# EAGLE schematic S7G7_footprint_simplified_w_ethernet_v1p5 (EAGLE 9.3.1)
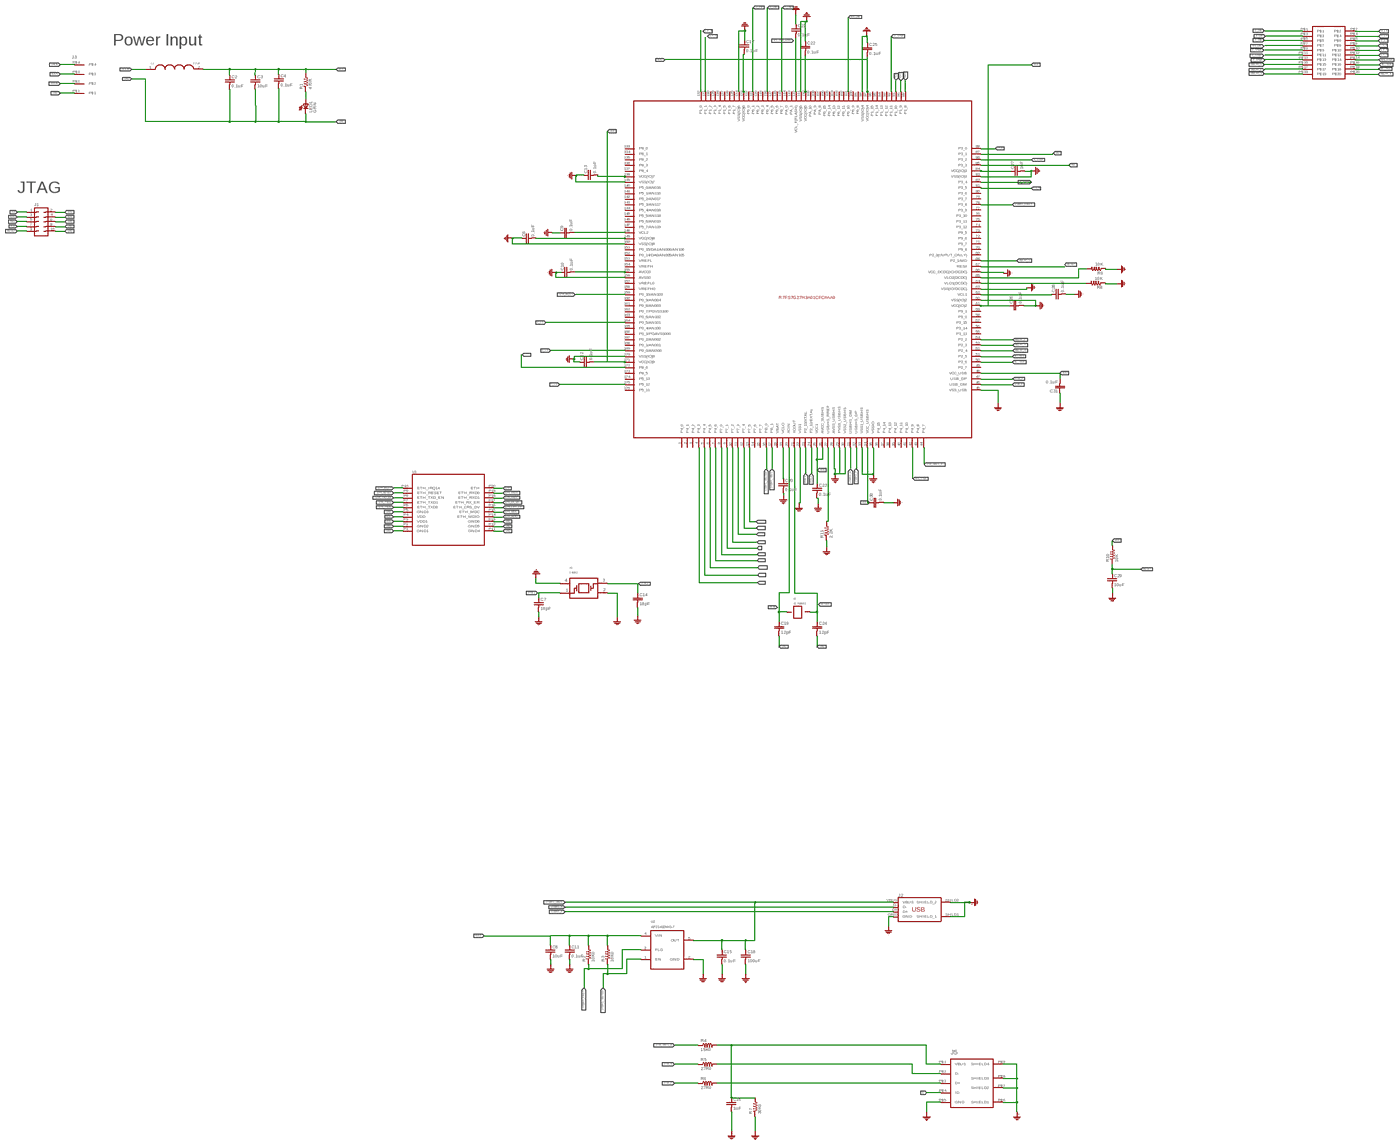
[diagram p0: schematic, sheet 1, overview]
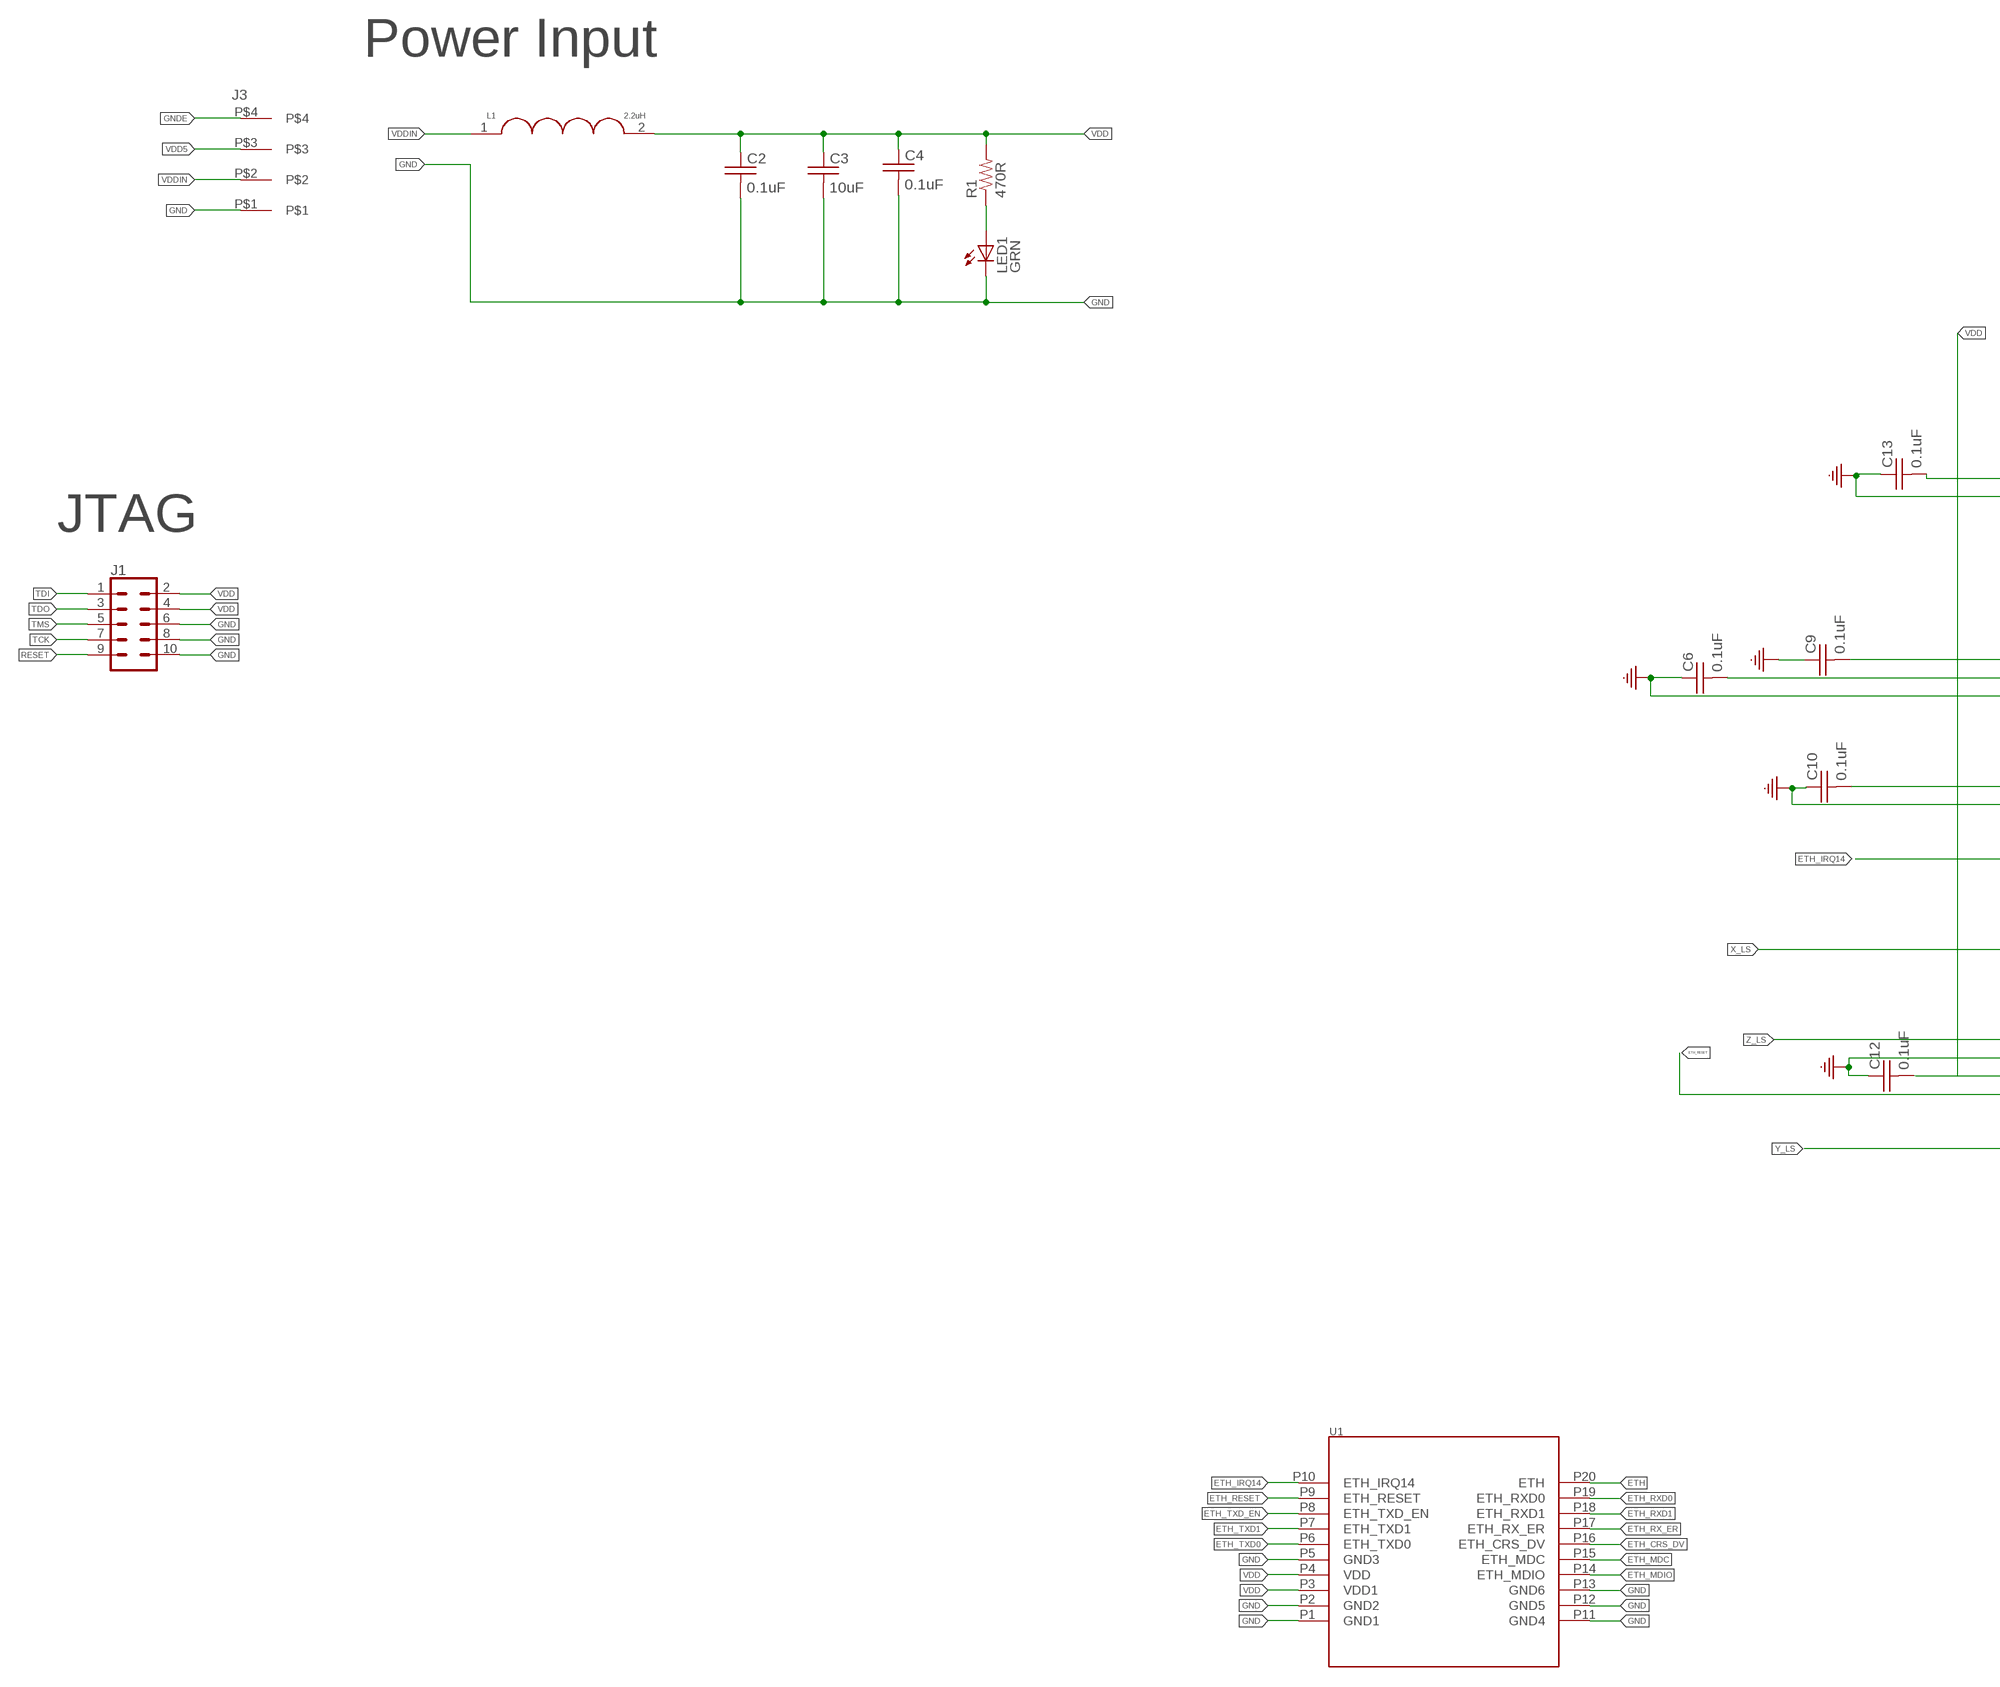
[diagram p1: schematic, sheet 1, part 1 of 4]
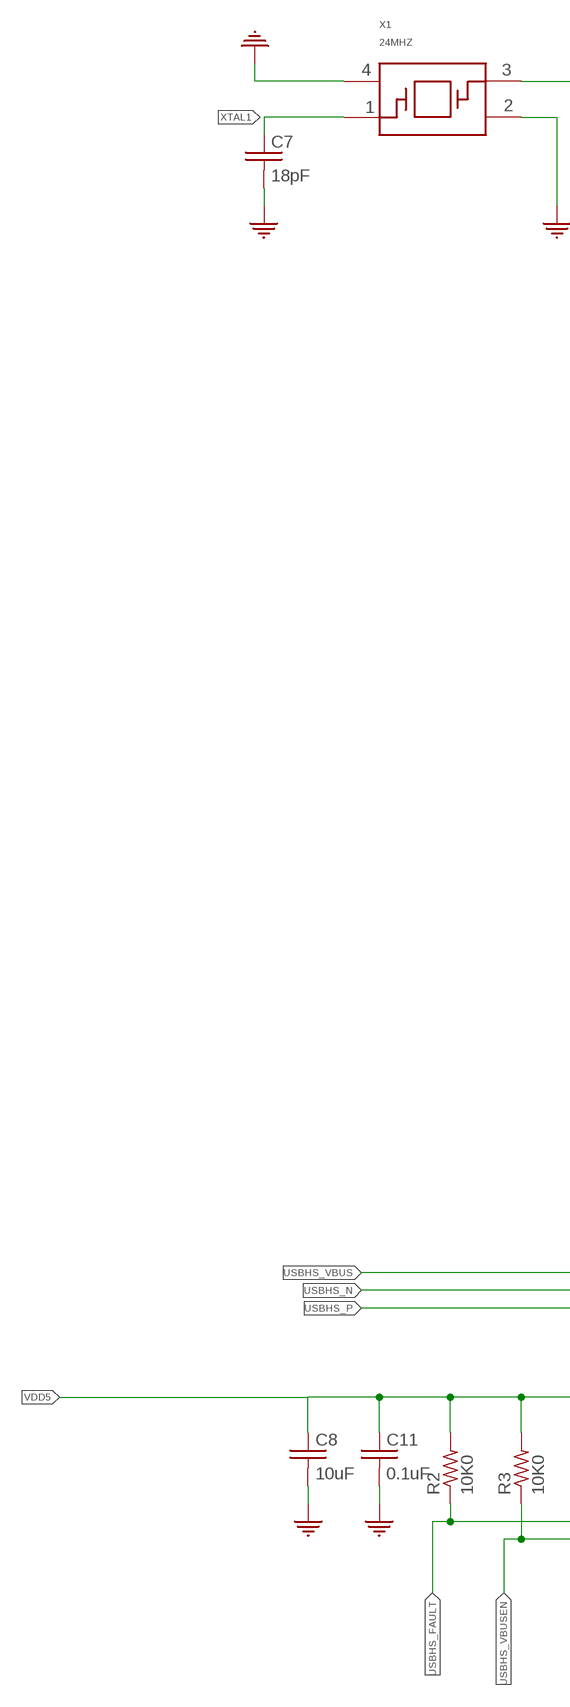
[diagram p2: schematic, sheet 1, part 2 of 4]
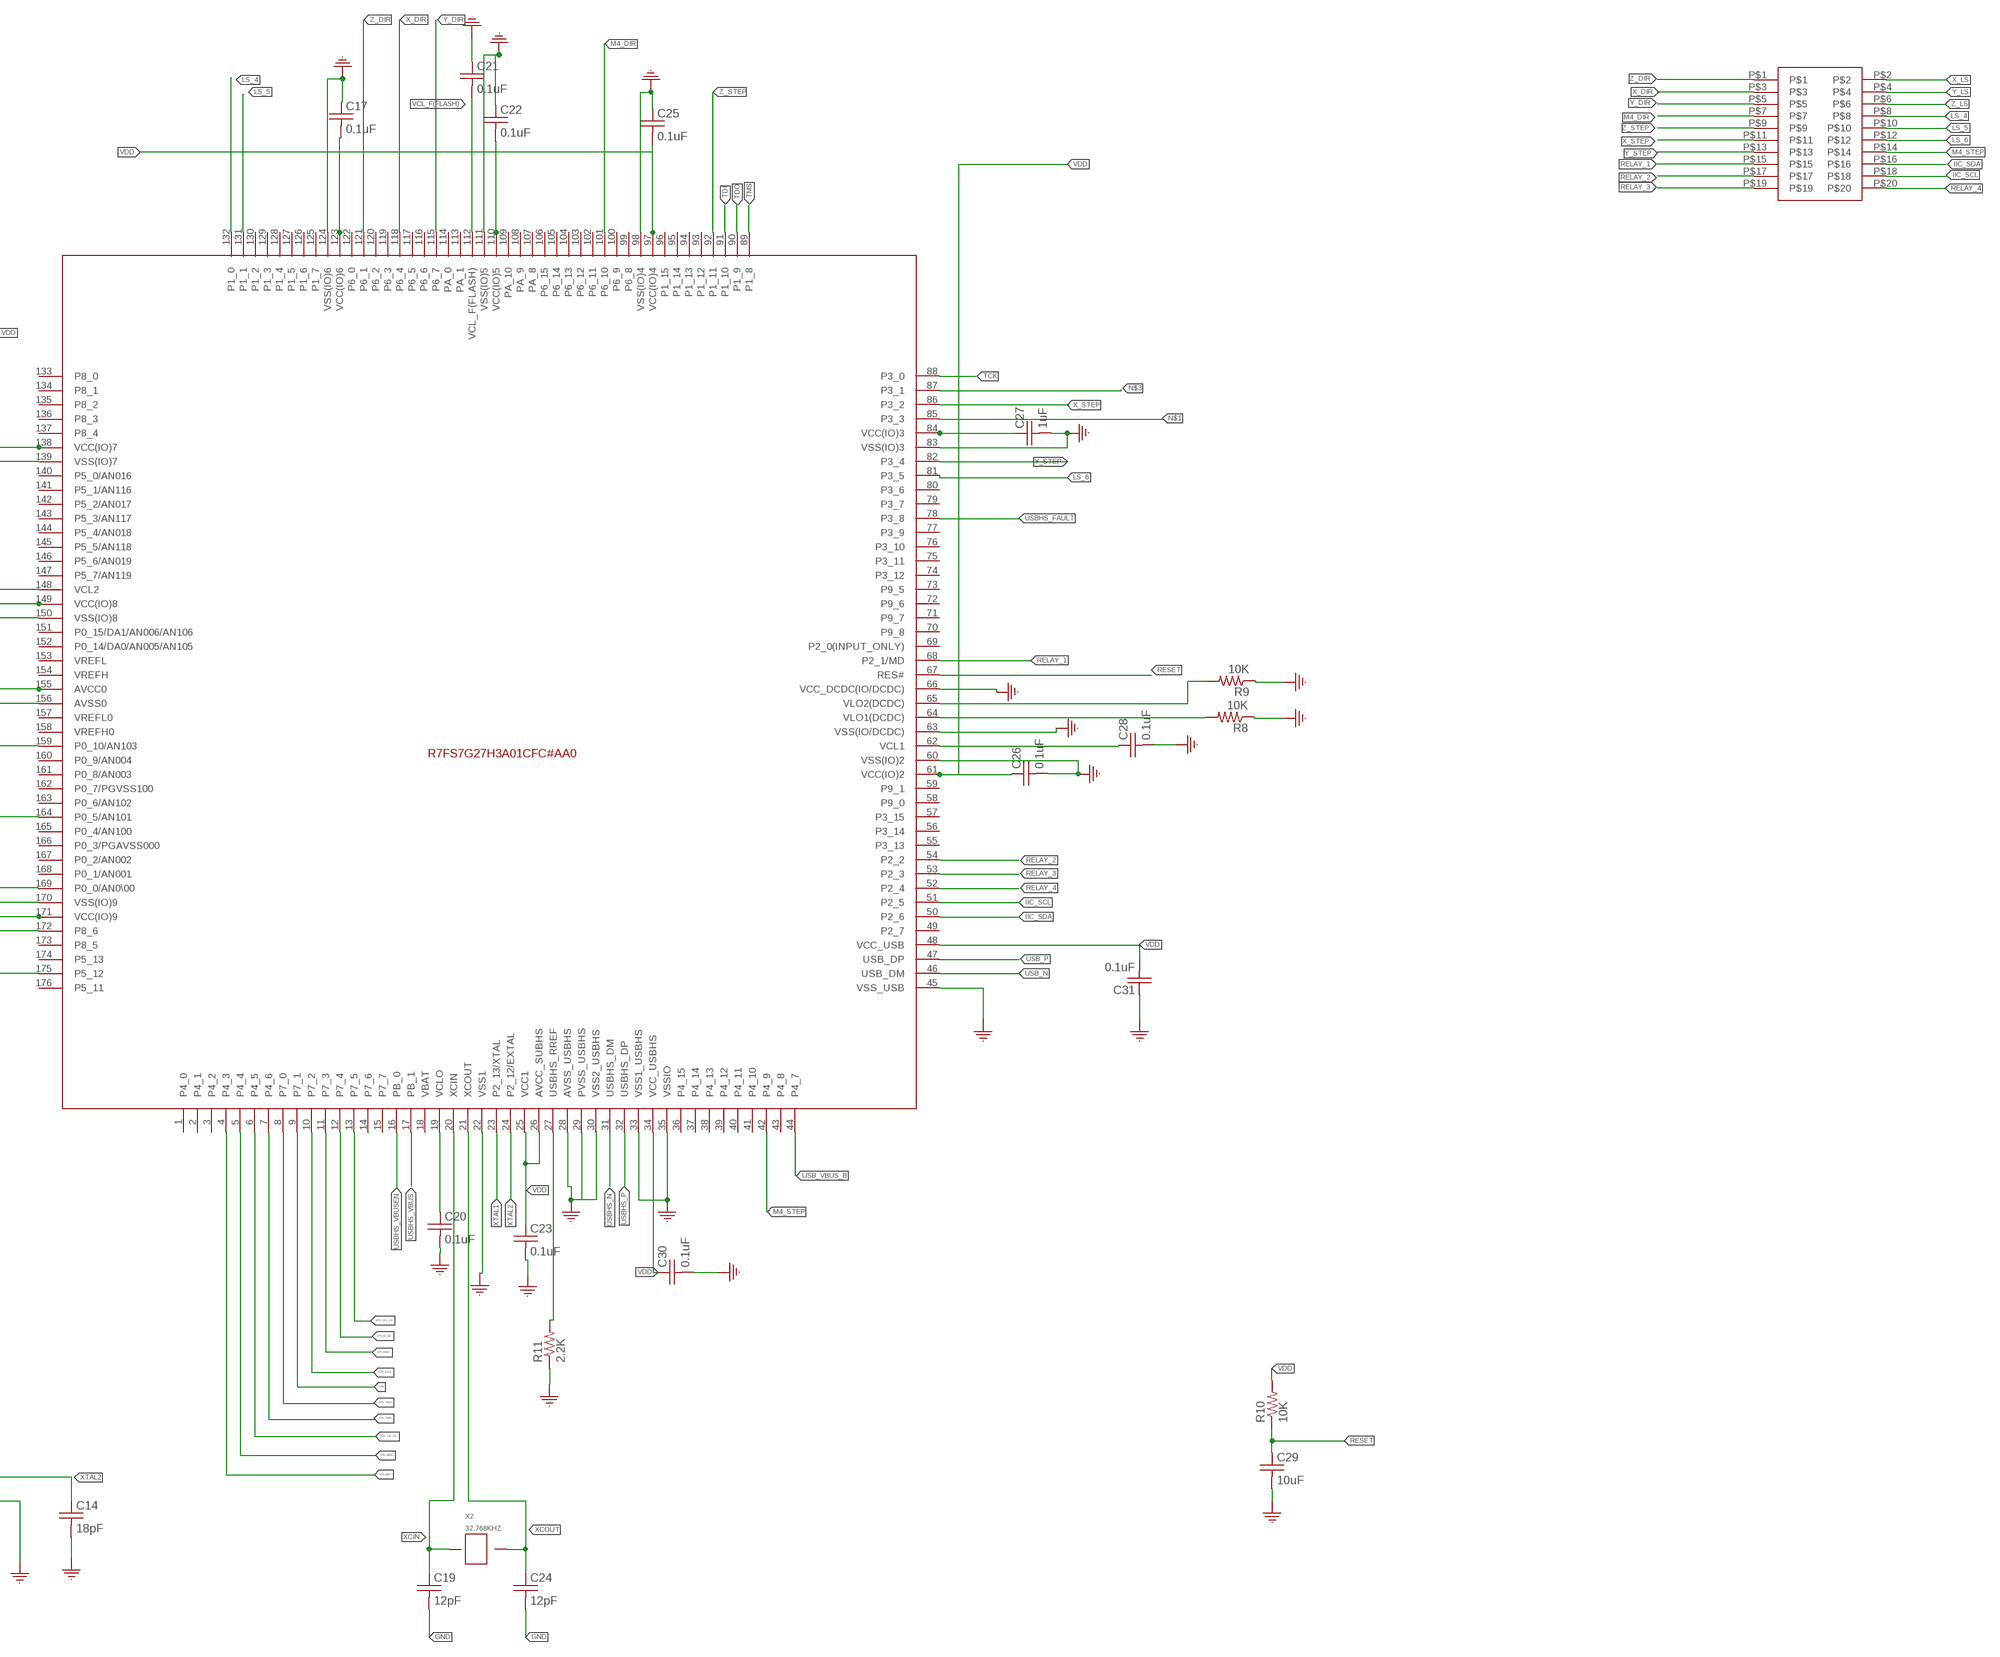
[diagram p3: schematic, sheet 1, part 3 of 4]
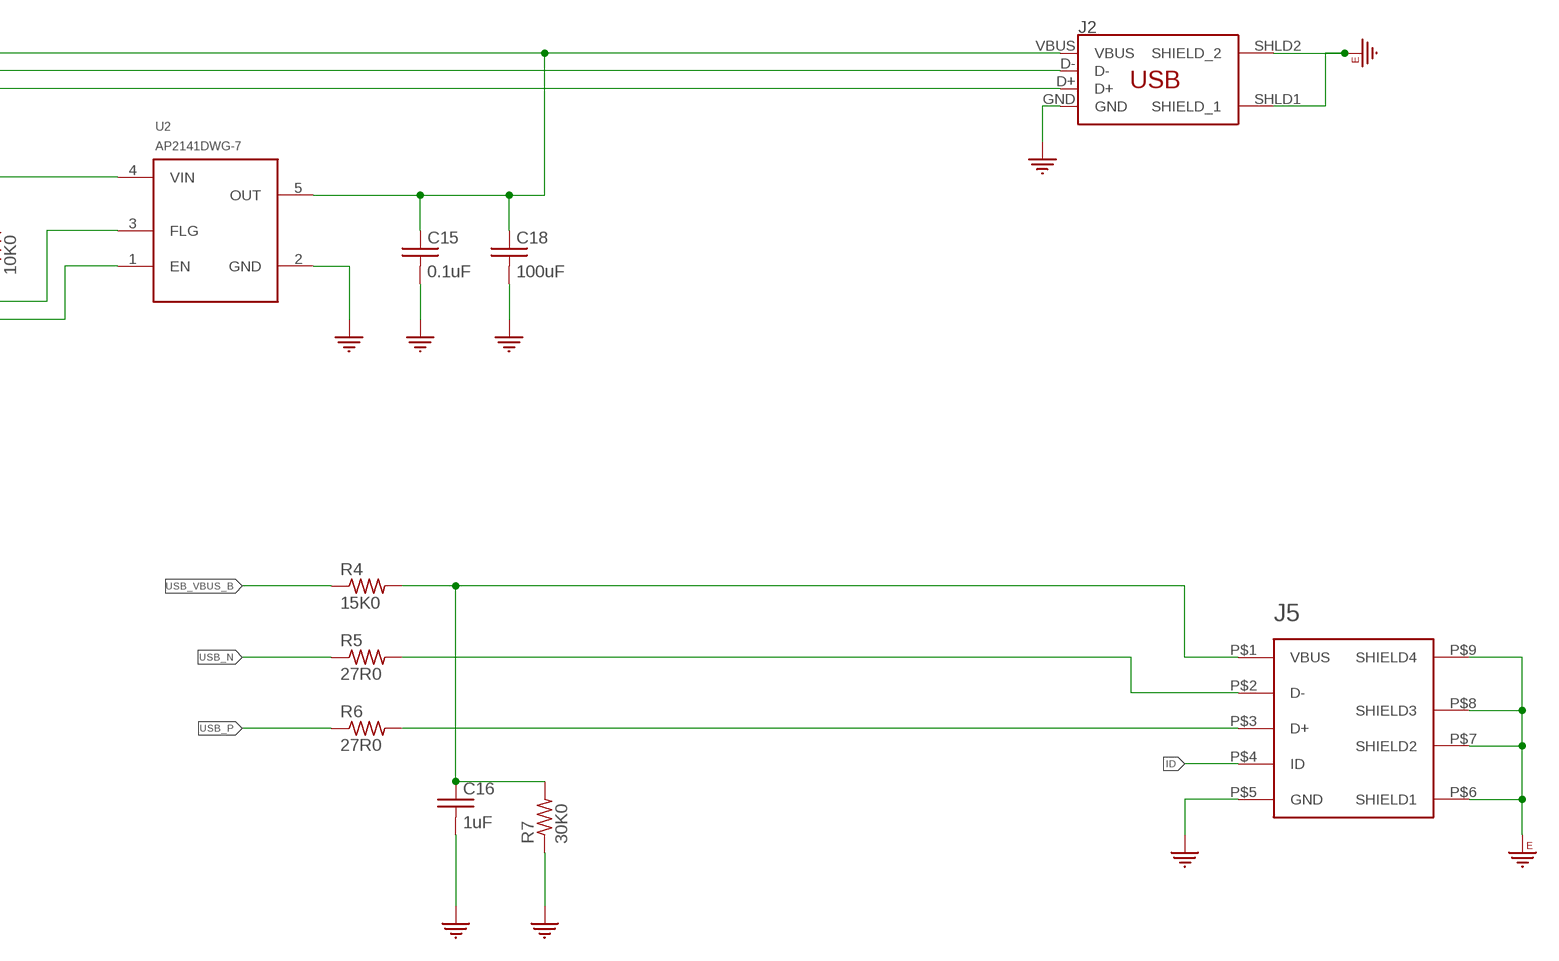
[diagram p4: schematic, sheet 1, part 4 of 4]

## Parts
C2  0.1uF  C_0402  [0402]
C3  10uF  C_0402  [0402]
C4  0.1uF  C_0402  [0402]
C6  0.1uF  C_0402  [0402]
C7  18pF  C_0402  [0402]
C8  10uF  C_0402  [0402]
C9  0.1uF  C_0402  [0402]
C10  0.1uF  C_0402  [0402]
C11  0.1uF  C_0402  [0402]
C12  0.1uF  C_0402  [0402]
C13  0.1uF  C_0402  [0402]
C14  18pF  C_0402  [0402]
C15  0.1uF  C_0402  [0402]
C16  1uF  C_0402  [0402]
C17  0.1uF  C_0402  [0402]
C18  100uF  C_1210  [C1210]
C19  12pF  C_0402  [0402]
C20  0.1uF  C_0402  [0402]
C21  0.1uF  C_0402  [0402]
C22  0.1uF  C_0402  [0402]
C23  0.1uF  C_0402  [0402]
C24  12pF  C_0402  [0402]
C25  0.1uF  C_0402  [0402]
C26  0.1uF  C_0402  [0402]
C27  1uF  C_0402  [0402]
C28  0.1uF  C_0402  [0402]
C29  10uF  C_0402  [0402]
C30  0.1uF  C_0402  [0402]
C31  0.1uF  C_0402  [0402]
J1  CONN_05X2PTH  [2X5]
J2  USB_A  [USB_A_SMT]
J3  3.81MM_1_X_4_RT_ANGLE_PLUG_HEADER  [1X4_3.81MM_PITCH]
J4  2_X_10_HEADER_GENERIC  [2_X_10_.1_INCH]
J5  USB_MICRO-B  [USB_MICRO-B]
L1  2.2uH  INDUCTOR_1008_2.2_MH_1.3A  [1008_(2520_METRIC)]
LED1  LED_0805_GREEN  [LED_0805_GREEN]
R1  470R  R_0402  [0402]
R2  10K0  R_0402  [0402]
R3  10K0  R_0402  [0402]
R4  15K0  R_0402  [0402]
R5  27R0  R_0402  [0402]
R6  27R0  R_0402  [0402]
R7  30K0  R_0402  [0402]
R8  10K  R_0402  [0402]
R9  10K  R_0402  [0402]
R10  10K  R_0402  [0402]
R11  2.2K  R_0402  [0402]
U1  ETHERNET_HAT  [ETHERNET_HAT]
U2  AP2141DWG-5  [SOT-23-5]
U5  S7G2_X_176  [LQFP176_24X24]
X1  24MHZ  XTAL_24_MHZ  [SMD_3225]
X2  32.768KHZ  XTAL_32.768KHZ  [SMD_X_2_PADS]

## Nets
D+: J5.P$3(D+) R6.P$2
D-: J5.P$2(D-) R5.P$2
ETH: U1.P20(ETH) U5.9(P7_1)
ETH_CRS_DV: U1.P16(ETH_CRS_DV) U5.13(P7_5)
ETH_IRQ14: U1.P10(ETH_IRQ14) U5.159(P0_10/AN103)
ETH_MDC: U1.P15(ETH_MDC) U5.4(P4_3)
ETH_MDIO: U1.P14(ETH_MDIO) U5.5(P4_4)
ETH_RESET: U1.P9(ETH_RESET) U5.172(P8_6)
ETH_RX_ER: U1.P17(ETH_RX_ER) U5.12(P7_4)
ETH_RXD0: U1.P19(ETH_RXD0) U5.10(P7_2)
ETH_RXD1: U1.P18(ETH_RXD1) U5.11(P7_3)
ETH_TXD0: U1.P6(ETH_TXD0) U5.8(P7_0)
ETH_TXD1: U1.P7(ETH_TXD1) U5.7(P4_6)
ETH_TXD_EN: U1.P8(ETH_TXD_EN) U5.6(P4_5)
GND: C2.P$2 C3.P$2 C4.P$2 C6.P$1 C7.P$2 C8.P$2 C9.P$1 C10.P$1 C11.P$2 C12.P$1 C13.P$1 C14.P$2 C15.P$2 C16.P$2 C17.P$1 C18.2 C19.P$2 C20.P$2 C21.P$1 C22.P$1 C23.P$2 C24.P$2 C25.P$1 C26.P$2 C27.P$2 C28.P$2 C29.P$2 C30.P$2 C31.P$1 J1.6 J1.8 J1.10 J2.GND J3.P$1 J5.P$5(GND) LED1.C R7.P$1 R8.P$1 R9.P$1 R11.P$1 U1.P1(GND1) U1.P2(GND2) U1.P5(GND3) U1.P11(GND4) U1.P12(GND5) U1.P13(GND6) U2.2(GND) U5.22(VSS1) U5.28(AVSS_USBHS) U5.29(PVSS_USBHS) U5.30(VSS2_USBHS) U5.33(VSS1_USBHS) U5.35(VSSIO) U5.45(VSS_USB) U5.60(VSS(IO)2) U5.63(VSS(IO/DCDC)) U5.66(VCC_DCDC(IO/DCDC)) U5.83(VSS(IO)3) U5.98(VSS(IO)4) U5.111(VSS(IO)5) U5.124(VSS(IO)6) U5.139(VSS(IO)7) U5.150(VSS(IO)8) U5.156(AVSS0) U5.170(VSS(IO)9) X1.2 X1.4
GNDE: J2.SHLD1(SHIELD_1) J2.SHLD2(SHIELD_2) J3.P$4 J5.P$6(SHIELD1) J5.P$7(SHIELD2) J5.P$8(SHIELD3) J5.P$9(SHIELD4)
ID: J5.P$4(ID)
IIC_SCL: J4.P$18 U5.51(P2_5)
IIC_SDA: J4.P$16 U5.50(P2_6)
LS_4: J4.P$8 U5.132(P1_0)
LS_5: J4.P$10 U5.131(P1_1)
LS_6: J4.P$12 U5.81(P3_5)
M4_DIR: J4.P$7 U5.101(P6_10)
M4_STEP: J4.P$14 U5.42(P4_9)
N$1: U5.85(P3_3)
N$2: R11.P$2 U5.27(USBHS_RREF)
N$3: U5.87(P3_1)
N$7: LED1.A R1.P$1
N$9: C9.P$2 U5.148(VCL2)
N$14: C20.P$1 U5.19(VCLO)
N$17: C28.P$1 U5.62(VCL1)
N$18: R8.P$2 U5.64(VLO1(DCDC))
N$19: R9.P$2 U5.65(VLO2(DCDC))
P706: U5.14(P7_6)
RELAY_1: J4.P$15 U5.68(P2_1/MD)
RELAY_2: J4.P$17 U5.54(P2_2)
RELAY_3: J4.P$19 U5.53(P2_3)
RELAY_4: J4.P$20 U5.52(P2_4)
RESET: C29.P$1 J1.9 R10.P$1 U5.67(RES#)
TCK: J1.7 U5.88(P3_0)
TDI: J1.1 U5.91(P1_10)
TDO: J1.3 U5.90(P1_9)
TMS: J1.5 U5.89(P1_8)
USB_N: R5.P$1 U5.46(USB_DM)
USB_P: R6.P$1 U5.47(USB_DP)
USB_VBUS_B: R4.P$1 U5.44(P4_7)
USBHS_FAULT: R2.P$1 U2.3(FLG) U5.78(P3_8)
USBHS_N: J2.D- U5.31(USBHS_DM)
USBHS_P: J2.D+ U5.32(USBHS_DP)
USBHS_VBUS: C15.P$1 C18.1 J2.VBUS U2.5(OUT) U5.17(PB_1)
USBHS_VBUSEN: R3.P$1 U2.1(EN) U5.16(PB_0)
VBUS: C16.P$1 J5.P$1(VBUS) R4.P$2 R7.P$2
VCL_F(FLASH): C21.P$2 U5.112(VCL_F(FLASH))
VDD: C2.P$1 C3.P$1 C4.P$1 C6.P$2 C10.P$2 C12.P$2 C13.P$2 C17.P$2 C22.P$2 C23.P$1 C25.P$2 C26.P$1 C27.P$1 C30.P$1 C31.P$2 J1.2 J1.4 L1.2 R1.P$2 R10.P$2 U1.P3(VDD1) U1.P4(VDD) U5.25(VCC1) U5.26(AVCC_SUBHS) U5.34(VCC_USBHS) U5.48(VCC_USB) U5.61(VCC(IO)2) U5.84(VCC(IO)3) U5.97(VCC(IO)4) U5.110(VCC(IO)5) U5.123(VCC(IO)6) U5.138(VCC(IO)7) U5.149(VCC(IO)8) U5.155(AVCC0) U5.171(VCC(IO)9)
VDD5: C8.P$1 C11.P$1 J3.P$3 R2.P$2 R3.P$2 U2.4(VIN)
VDDIN: J3.P$2 L1.1
X_DIR: J4.P$3 U5.118(P6_4)
X_LS: J4.P$2 U5.164(P0_5/AN101)
X_STEP: J4.P$11 U5.86(P3_2)
XCIN: C19.P$1 U5.20(XCIN) X2.P$1
XCOUT: C24.P$1 U5.21(XCOUT) X2.P$2
XTAL1: C7.P$1 U5.23(P2_13/XTAL) X1.1
XTAL2: C14.P$1 U5.24(P2_12/EXTAL) X1.3
Y_DIR: J4.P$5 U5.115(P6_7)
Y_LS: J4.P$4 U5.175(P5_12)
Y_STEP: J4.P$13 U5.82(P3_4)
Z_DIR: J4.P$1 U5.121(P6_1)
Z_LS: J4.P$6 U5.169(P0_0/AN0\00)
Z_STEP: J4.P$9 U5.92(P1_11)
Unconnected: U5.1(P4_0) U5.2(P4_1) U5.3(P4_2) U5.15(P7_7) U5.18(VBAT) U5.36(P4_15) U5.37(P4_14) U5.38(P4_13) U5.39(P4_12) U5.40(P4_11) U5.41(P4_10) U5.43(P4_8) U5.49(P2_7) U5.55(P3_13) U5.56(P3_14) U5.57(P3_15) U5.58(P9_0) U5.59(P9_1) U5.69(P2_0(INPUT_ONLY)) U5.70(P9_8) U5.71(P9_7) U5.72(P9_6) U5.73(P9_5) U5.74(P3_12) U5.75(P3_11) U5.76(P3_10) U5.77(P3_9) U5.79(P3_7) U5.80(P3_6) U5.93(P1_12) U5.94(P1_13) U5.95(P1_14) U5.96(P1_15) U5.99(P6_8) U5.100(P6_9) U5.102(P6_11) U5.103(P6_12) U5.104(P6_13) U5.105(P6_14) U5.106(P6_15) U5.107(PA_8) U5.108(PA_9) U5.109(PA_10) U5.113(PA_1) U5.114(PA_0) U5.116(P6_6) U5.117(P6_5) U5.119(P6_3) U5.120(P6_2) U5.122(P6_0) U5.125(P1_7) U5.126(P1_6) U5.127(P1_5) U5.128(P1_4) U5.129(P1_3) U5.130(P1_2) U5.133(P8_0) U5.134(P8_1) U5.135(P8_2) U5.136(P8_3) U5.137(P8_4) U5.140(P5_0/AN016) U5.141(P5_1/AN116) U5.142(P5_2/AN017) U5.143(P5_3/AN117) U5.144(P5_4/AN018) U5.145(P5_5/AN118) U5.146(P5_6/AN019) U5.147(P5_7/AN119) U5.151(P0_15/DA1/AN006/AN106) U5.152(P0_14/DA0/AN005/AN105) U5.153(VREFL) U5.154(VREFH) U5.157(VREFL0) U5.158(VREFH0) U5.160(P0_9/AN004) U5.161(P0_8/AN003) U5.162(P0_7/PGVSS100) U5.163(P0_6/AN102) U5.165(P0_4/AN100) U5.166(P0_3/PGAVSS000) U5.167(P0_2/AN002) U5.168(P0_1/AN001) U5.173(P8_5) U5.174(P5_13) U5.176(P5_11)

## Notes on the sheet
- Power Input
- JTAG

## Library data of the parts
C2-C4 C6-C17 C19-C31 = 3D_MIG_Controller:C_0402
C18 = 3D_MIG_Controller:C_1210
J1 = 3D_MIG_Controller:CONN_05X2: Multi connection point. Often used as Generic Header-pin footprint for 0.1 inch spaced/style header connections For AVR SPI programming port, see special device with nice symbol: "AVR_SPI_PROG_5x2.dev" You can populate with any combo of single row headers, but if you'd like an exact match, check these: 2x5 AVR ICSP Male Header <https://www.sparkfun.com/products/778> (PRT-00778) 2x5 Pin Shrouded Header <https://www.sparkfun.com/products/8506> (PRT-08506) On any of the 0.1 inch spaced packages, you can populate with these: Break Away Headers - Straight <https://www.sparkfun.com/products/116> (PRT-00116) Break Away Male Headers - Right Angle <https://www.sparkfun.com/products/553> (PRT-00553) Female Headers <https://www.sparkfun.com/products/115> (PRT-00115) Break Away Headers - Machine Pin <https://www.sparkfun.com/products/117> (PRT-00117) Break Away Female Headers - Swiss Machine Pin <https://www.sparkfun.com/products/743> (PRT-00743) Special note: the shrouded connector mates well with our 5x2 ribbon cables: 2x5 Pin IDC Ribbon Cable <https://www.sparkfun.com/products/8535> (PRT-08535); PROD_ID: CONN-08499; SF_ID: PRT-0778
J2 = 3D_MIG_Controller:USB_A: USB-A Connector Male and female variants, as well as PTH and SMT variants SparkFun Products: SparkFun XBee Explorer Dongle <https://www.sparkfun.com/products/11697> PTH Male SparkFun MicroView-USB Programmer <https://www.sparkfun.com/products/12924> SMT Male SparkFun USB Type A Female Breakout <https://www.sparkfun.com/products/12700> SMT Female
J3 = 3D_MIG_Controller:3.81MM_1_X_4_RT_ANGLE_PLUG_HEADER
J4 = 3D_MIG_Controller:2_X_10_HEADER_GENERIC
J5 = 3D_MIG_Controller:USB_MICRO-B
L1 = 3D_MIG_Controller:INDUCTOR_1008_2.2_MH_1.3A
LED1 = 3D_MIG_Controller:LED_0805_GREEN
R1-R11 = 3D_MIG_Controller:R_0402
U1 = 3D_MIG_Controller:ETHERNET_HAT
U2 = 3D_MIG_Controller:AP2141DWG-5
U5 = 3D_MIG_Controller:S7G2_X_176
X1 = 3D_MIG_Controller:XTAL_24_MHZ
X2 = 3D_MIG_Controller:XTAL_32.768KHZ